# Altium schematic sheet BlueLed.SchDoc
size A4
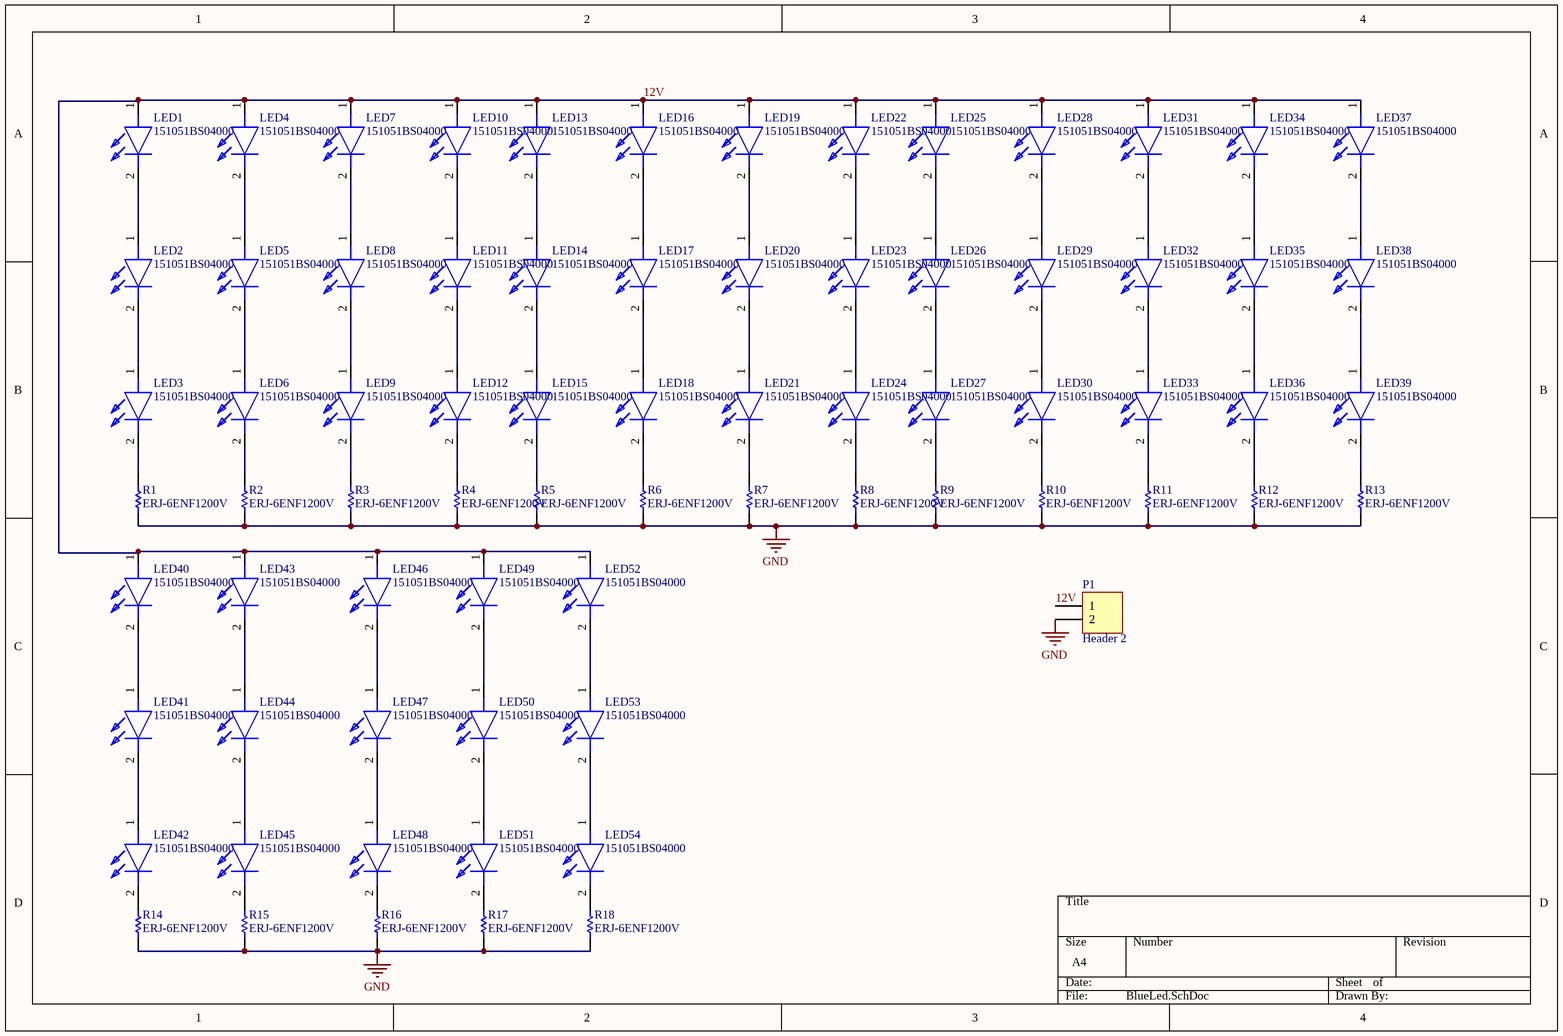
[diagram p0: BlueLed.SchDoc]

## Parts
LED1  151051BS04000  [151051BS04000]
LED2  151051BS04000  [151051BS04000]
LED3  151051BS04000  [151051BS04000]
LED4  151051BS04000  [151051BS04000]
LED5  151051BS04000  [151051BS04000]
LED6  151051BS04000  [151051BS04000]
LED7  151051BS04000  [151051BS04000]
LED8  151051BS04000  [151051BS04000]
LED9  151051BS04000  [151051BS04000]
LED10  151051BS04000  [151051BS04000]
LED11  151051BS04000  [151051BS04000]
LED12  151051BS04000  [151051BS04000]
LED13  151051BS04000  [151051BS04000]
LED14  151051BS04000  [151051BS04000]
LED15  151051BS04000  [151051BS04000]
LED16  151051BS04000  [151051BS04000]
LED17  151051BS04000  [151051BS04000]
LED18  151051BS04000  [151051BS04000]
LED19  151051BS04000  [151051BS04000]
LED20  151051BS04000  [151051BS04000]
LED21  151051BS04000  [151051BS04000]
LED22  151051BS04000  [151051BS04000]
LED23  151051BS04000  [151051BS04000]
LED24  151051BS04000  [151051BS04000]
LED25  151051BS04000  [151051BS04000]
LED26  151051BS04000  [151051BS04000]
LED27  151051BS04000  [151051BS04000]
LED28  151051BS04000  [151051BS04000]
LED29  151051BS04000  [151051BS04000]
LED30  151051BS04000  [151051BS04000]
LED31  151051BS04000  [151051BS04000]
LED32  151051BS04000  [151051BS04000]
LED33  151051BS04000  [151051BS04000]
LED34  151051BS04000  [151051BS04000]
LED35  151051BS04000  [151051BS04000]
LED36  151051BS04000  [151051BS04000]
LED37  151051BS04000  [151051BS04000]
LED38  151051BS04000  [151051BS04000]
LED39  151051BS04000  [151051BS04000]
LED40  151051BS04000  [151051BS04000]
LED41  151051BS04000  [151051BS04000]
LED42  151051BS04000  [151051BS04000]
LED43  151051BS04000  [151051BS04000]
LED44  151051BS04000  [151051BS04000]
LED45  151051BS04000  [151051BS04000]
LED46  151051BS04000  [151051BS04000]
LED47  151051BS04000  [151051BS04000]
LED48  151051BS04000  [151051BS04000]
LED49  151051BS04000  [151051BS04000]
LED50  151051BS04000  [151051BS04000]
LED51  151051BS04000  [151051BS04000]
LED52  151051BS04000  [151051BS04000]
LED53  151051BS04000  [151051BS04000]
LED54  151051BS04000  [151051BS04000]
P1  Header 2  [HDR1X2]
R1  ERJ-6ENF1200V  [RESC2013X70X40NL20T20]
R2  ERJ-6ENF1200V  [RESC2013X70X40NL20T20]
R3  ERJ-6ENF1200V  [RESC2013X70X40NL20T20]
R4  ERJ-6ENF1200V  [RESC2013X70X40NL20T20]
R5  ERJ-6ENF1200V  [RESC2013X70X40NL20T20]
R6  ERJ-6ENF1200V  [RESC2013X70X40NL20T20]
R7  ERJ-6ENF1200V  [RESC2013X70X40NL20T20]
R8  ERJ-6ENF1200V  [RESC2013X70X40NL20T20]
R9  ERJ-6ENF1200V  [RESC2013X70X40NL20T20]
R10  ERJ-6ENF1200V  [RESC2013X70X40NL20T20]
R11  ERJ-6ENF1200V  [RESC2013X70X40NL20T20]
R12  ERJ-6ENF1200V  [RESC2013X70X40NL20T20]
R13  ERJ-6ENF1200V  [RESC2013X70X40NL20T20]
R14  ERJ-6ENF1200V  [RESC2013X70X40NL20T20]
R15  ERJ-6ENF1200V  [RESC2013X70X40NL20T20]
R16  ERJ-6ENF1200V  [RESC2013X70X40NL20T20]
R17  ERJ-6ENF1200V  [RESC2013X70X40NL20T20]
R18  ERJ-6ENF1200V  [RESC2013X70X40NL20T20]

## Nets
GND: P1.2 R1.1 R2.1 R3.1 R4.1 R5.1 R6.1 R7.1 R8.1 R9.1 R10.1 R11.1 R12.1 R13.1 R14.1 R15.1 R16.1 R17.1 R18.1
12V: LED1.1(A) LED4.1(A) LED7.1(A) LED10.1(A) LED13.1(A) LED16.1(A) LED19.1(A) LED22.1(A) LED25.1(A) LED28.1(A) LED31.1(A) LED34.1(A) LED37.1(A) LED40.1(A) LED43.1(A) LED46.1(A) LED49.1(A) LED52.1(A) P1.1
NetLED1_2: LED1.2(K) LED2.1(A)
NetLED2_2: LED2.2(K) LED3.1(A)
NetLED3_2: LED3.2(K) R1.2
NetLED4_2: LED4.2(K) LED5.1(A)
NetLED5_2: LED5.2(K) LED6.1(A)
NetLED6_2: LED6.2(K) R2.2
NetLED7_2: LED7.2(K) LED8.1(A)
NetLED8_2: LED8.2(K) LED9.1(A)
NetLED9_2: LED9.2(K) R3.2
NetLED10_2: LED10.2(K) LED11.1(A)
NetLED11_2: LED11.2(K) LED12.1(A)
NetLED12_2: LED12.2(K) R4.2
NetLED13_2: LED13.2(K) LED14.1(A)
NetLED14_2: LED14.2(K) LED15.1(A)
NetLED15_2: LED15.2(K) R5.2
NetLED16_2: LED16.2(K) LED17.1(A)
NetLED17_2: LED17.2(K) LED18.1(A)
NetLED18_2: LED18.2(K) R6.2
NetLED19_2: LED19.2(K) LED20.1(A)
NetLED20_2: LED20.2(K) LED21.1(A)
NetLED21_2: LED21.2(K) R7.2
NetLED22_2: LED22.2(K) LED23.1(A)
NetLED23_2: LED23.2(K) LED24.1(A)
NetLED24_2: LED24.2(K) R8.2
NetLED25_2: LED25.2(K) LED26.1(A)
NetLED26_2: LED26.2(K) LED27.1(A)
NetLED27_2: LED27.2(K) R9.2
NetLED28_2: LED28.2(K) LED29.1(A)
NetLED29_2: LED29.2(K) LED30.1(A)
NetLED30_2: LED30.2(K) R10.2
NetLED31_2: LED31.2(K) LED32.1(A)
NetLED32_2: LED32.2(K) LED33.1(A)
NetLED33_2: LED33.2(K) R11.2
NetLED34_2: LED34.2(K) LED35.1(A)
NetLED35_2: LED35.2(K) LED36.1(A)
NetLED36_2: LED36.2(K) R12.2
NetLED37_2: LED37.2(K) LED38.1(A)
NetLED38_2: LED38.2(K) LED39.1(A)
NetLED39_2: LED39.2(K) R13.2
NetLED40_2: LED40.2(K) LED41.1(A)
NetLED41_2: LED41.2(K) LED42.1(A)
NetLED42_2: LED42.2(K) R14.2
NetLED43_2: LED43.2(K) LED44.1(A)
NetLED44_2: LED44.2(K) LED45.1(A)
NetLED45_2: LED45.2(K) R15.2
NetLED46_2: LED46.2(K) LED47.1(A)
NetLED47_2: LED47.2(K) LED48.1(A)
NetLED48_2: LED48.2(K) R16.2
NetLED49_2: LED49.2(K) LED50.1(A)
NetLED50_2: LED50.2(K) LED51.1(A)
NetLED51_2: LED51.2(K) R17.2
NetLED52_2: LED52.2(K) LED53.1(A)
NetLED53_2: LED53.2(K) LED54.1(A)
NetLED54_2: LED54.2(K) R18.2

## Library data of the parts
LED1-LED54 = 151051BS04000: LED; Manufacturer_Name: Wurth Elektronik; Datasheet Link: https://katalog.we-online.de/led/datasheet/151051BS04000.pdf; Height: 8.95mm; Manufacturer_Part_Number: 151051BS04000; Mouser Part Number: 710-151051BS04000; Mouser Price/Stock: https://www.mouser.co.uk/ProductDetail/Wurth-Elektronik/151051BS04000?qs=LlUlMxKIyB3OjuZOlqaOjg%3D%3D
P1 = Header 2: Header, 2-Pin; LatestRevisionDate: 17-Jul-2002; LatestRevisionNote: Re-released for DXP Platform.; Publisher: Altium Limited
R1-R18 = CMP-2001-00511-5: Chip Resistor, 120 Ohm, +/- 1%, 0.125 W, -55 to 155 degC, 0805 (2012 Metric), RoHS, Tape and Reel; Manufacturer: Panasonic; Voltage Rating: 150 V; Mount: Surface Mount; ComponentLink1Description: Manufacturer URL; ComponentLink1URL: http://www.panasonic.com/; RoHSCompliant: true; Min Operating Temperature: -55 degC; Length: 2 mm; Max Operating Temperature: 155 degC; Packaging: Tape and Reel; Package Quantity: 5000; REACH SVHC: Yes; Pins: 2; ComponentLink2Description: Datasheet; DatasheetVersion: 04/2015; PackageReference: 0805; ComponentLink2URL: http://industrial.panasonic.com/cdbs/www-data/pdf/RDA0000/AOA0000C86.pdf; Mounting Technology: Surface Mount; PackageDescription: 2-Pin Surface Mount Device, Body 2 x 1.25 mm; Height: 0.6 mm